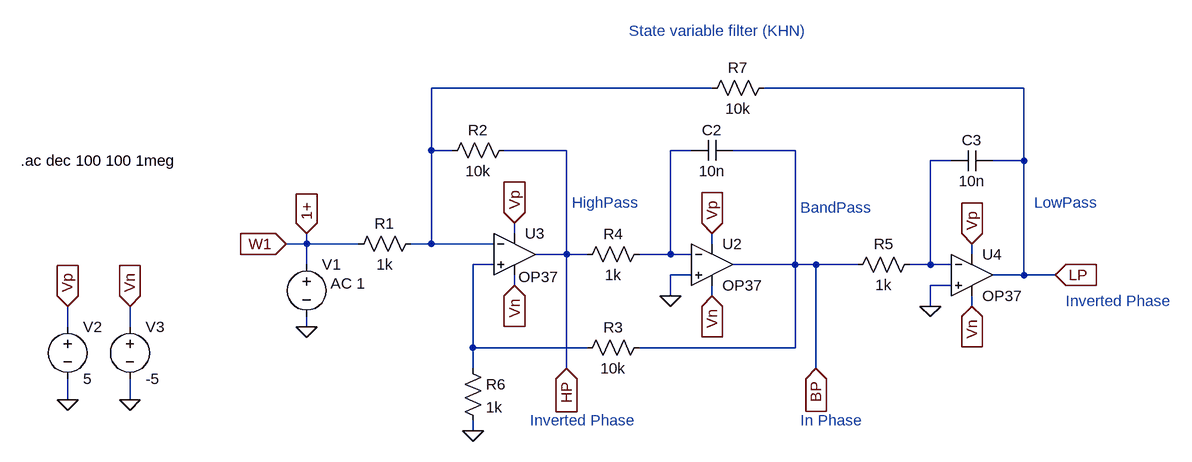
[diagram p0: schematic svf_khn.asc]
svf_khn.asc, the LTspice schematic file:
Version 4
SHEET 1 1356 1244
WIRE 624 352 192 352
WIRE 1104 352 704 352
WIRE 192 448 192 352
WIRE 224 448 192 448
WIRE 400 448 304 448
WIRE 592 448 560 448
WIRE 752 448 656 448
WIRE 992 464 960 464
WIRE 1104 464 1104 352
WIRE 1104 464 1056 464
WIRE 320 576 320 560
WIRE 0 592 0 576
WIRE 0 592 -32 592
WIRE 80 592 0 592
WIRE 192 592 192 448
WIRE 192 592 160 592
WIRE 288 592 192 592
WIRE 624 592 624 576
WIRE 400 608 400 448
WIRE 400 608 352 608
WIRE 432 608 400 608
WIRE 560 608 560 448
WIRE 560 608 512 608
WIRE 592 608 560 608
WIRE 1024 608 1024 592
WIRE 0 624 0 592
WIRE 288 624 256 624
WIRE 752 624 752 448
WIRE 752 624 656 624
WIRE 784 624 752 624
WIRE 848 624 784 624
WIRE 960 624 960 464
WIRE 960 624 928 624
WIRE 992 624 960 624
WIRE 592 640 560 640
WIRE 1104 640 1104 464
WIRE 1104 640 1056 640
WIRE 1152 640 1104 640
WIRE 320 656 320 640
WIRE 992 656 960 656
WIRE 560 672 560 640
WIRE 624 672 624 656
WIRE 960 688 960 656
WIRE 1024 688 1024 672
WIRE -368 720 -368 688
WIRE -272 720 -272 688
WIRE 0 720 0 704
WIRE 256 752 256 624
WIRE 432 752 256 752
WIRE 752 752 752 624
WIRE 752 752 512 752
WIRE 256 784 256 752
WIRE 400 784 400 608
WIRE 784 784 784 624
WIRE -368 832 -368 800
WIRE -272 832 -272 800
WIRE 256 880 256 864
FLAG 0 720 0
FLAG -32 592 W1
IOPIN -32 592 In
FLAG 0 576 1+
IOPIN 0 576 In
FLAG -368 832 0
FLAG -272 832 0
FLAG -368 688 Vp
IOPIN -368 688 In
FLAG -272 688 Vn
IOPIN -272 688 In
FLAG 560 672 0
FLAG 624 576 Vp
IOPIN 624 576 In
FLAG 624 672 Vn
IOPIN 624 672 In
FLAG 320 560 Vp
IOPIN 320 560 In
FLAG 320 656 Vn
IOPIN 320 656 In
FLAG 960 688 0
FLAG 1024 592 Vp
IOPIN 1024 592 In
FLAG 1024 688 Vn
IOPIN 1024 688 In
FLAG 256 880 0
FLAG 400 784 HP
IOPIN 400 784 In
FLAG 784 784 BP
IOPIN 784 784 In
FLAG 1152 640 LP
IOPIN 1152 640 In
SYMBOL voltage 0 608 R0
WINDOW 123 37 45 Left 2
WINDOW 39 0 0 Left 0
SYMATTR Value2 AC 1
SYMATTR InstName V1
SYMATTR Value ""
SYMBOL voltage -368 704 R0
WINDOW 123 0 0 Left 0
WINDOW 39 0 0 Left 0
SYMATTR InstName V2
SYMATTR Value 5
SYMBOL voltage -272 704 R0
WINDOW 123 0 0 Left 0
WINDOW 39 0 0 Left 0
SYMATTR InstName V3
SYMATTR Value -5
SYMBOL Opamps\\OP37 624 560 R0
SYMATTR InstName U2
SYMBOL res 528 592 R90
WINDOW 0 0 56 VBottom 2
WINDOW 3 32 56 VTop 2
SYMATTR InstName R4
SYMATTR Value 1k
SYMBOL cap 656 432 R90
WINDOW 0 0 32 VBottom 2
WINDOW 3 32 32 VTop 2
SYMATTR InstName C2
SYMATTR Value 10n
SYMBOL res 176 576 R90
WINDOW 0 0 56 VBottom 2
WINDOW 3 32 56 VTop 2
SYMATTR InstName R1
SYMATTR Value 1k
SYMBOL res 320 432 R90
WINDOW 0 0 56 VBottom 2
WINDOW 3 32 56 VTop 2
SYMATTR InstName R2
SYMATTR Value 10k
SYMBOL Opamps\\OP37 320 544 R0
WINDOW 3 6 99 Left 2
SYMATTR InstName U3
SYMBOL Opamps\\OP37 1024 576 R0
SYMATTR InstName U4
SYMBOL res 944 608 R90
WINDOW 0 0 56 VBottom 2
WINDOW 3 32 56 VTop 2
SYMATTR InstName R5
SYMATTR Value 1k
SYMBOL cap 1056 448 R90
WINDOW 0 0 32 VBottom 2
WINDOW 3 32 32 VTop 2
SYMATTR InstName C3
SYMATTR Value 10n
SYMBOL res 528 736 R90
WINDOW 0 0 56 VBottom 2
WINDOW 3 32 56 VTop 2
SYMATTR InstName R3
SYMATTR Value 10k
SYMBOL res 240 768 R0
SYMATTR InstName R6
SYMATTR Value 1k
SYMBOL res 720 336 R90
WINDOW 0 0 56 VBottom 2
WINDOW 3 32 56 VTop 2
SYMATTR InstName R7
SYMATTR Value 10k
TEXT -440 464 Left 2 !.ac dec 100 100 1meg
TEXT 496 264 Left 2 ;State variable filter (KHN)
TEXT 760 536 Left 2 ;BandPass
TEXT 408 528 Left 2 ;HighPass
TEXT 1120 528 Left 2 ;LowPass
TEXT 344 864 Left 2 ;Inverted Phase
TEXT 1168 680 Left 2 ;Inverted Phase
TEXT 760 864 Left 2 ;In Phase

The netlist it stands for:
* svf_khn.asc
V1 1+ 0 AC 1
V2 Vp 0 5
V3 Vn 0 -5
XU2 0 N002 Vp Vn BP LT1037  ; OP37, pins In+ In- V+ V- OUT
R4 N002 HP 1k
C2 BP N002 10n
R1 N001 1+ 1k
R2 HP N001 10k
XU3 N004 N001 Vp Vn HP LT1037  ; OP37, pins In+ In- V+ V- OUT
XU4 0 N003 Vp Vn LP LT1037  ; OP37, pins In+ In- V+ V- OUT
R5 N003 BP 1k
C3 LP N003 10n
R3 BP N004 10k
R6 N004 0 1k
R7 LP N001 10k
.ac dec 100 100 1meg
* State variable filter (KHN)
* BandPass
* HighPass
* LowPass
* Inverted Phase
* Inverted Phase
* In Phase
.lib LTC.lib
.backanno
.end